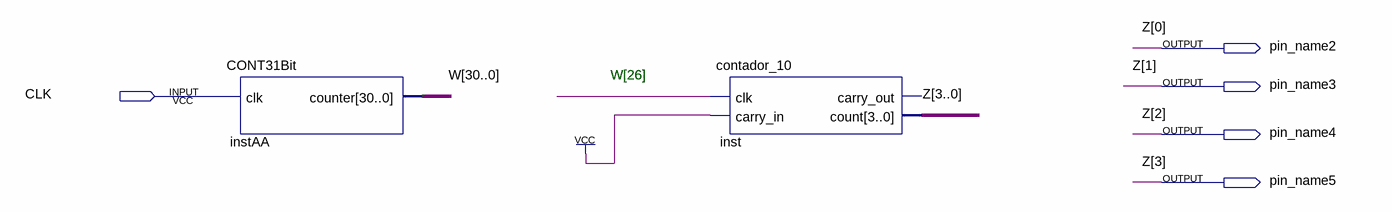
[diagram p0: schematic sheet]
// Quartus schematic PRUEBA2.bdf as structural Verilog: 2 symbols, 5 pins
module PRUEBA2 (
  input  CLK,
  output pin_name2,
  output pin_name3,
  output pin_name4,
  output pin_name5
);

  wire [30:0] W;

  CONT31Bit instAA (.clk(CLK), .counter(W));
  contador_10 inst (
    .clk(W[26]), .carry_in(1'b1), .count({pin_name5, pin_name4, pin_name3, pin_name2}));  // open: carry_out

  // Other names for the same wires on the sheet: Z[3:0] = {pin_name5, pin_name4, pin_name3, pin_name2}

  // Notes on the sheet:
  //   W[26]
endmodule
